# Altium schematic sheet Преобразователь напряжения.SchDoc: Преобразователь
size 420 x 297 mm; ApprovedBy: Капустин; CheckedBy: Капустин; DrawnBy: Хомутов; DocumentNumber: СКТБ.421455.001 Э3; SheetNumber: 1; SheetTotal: 2; Title1str: напряжений; Format: A3
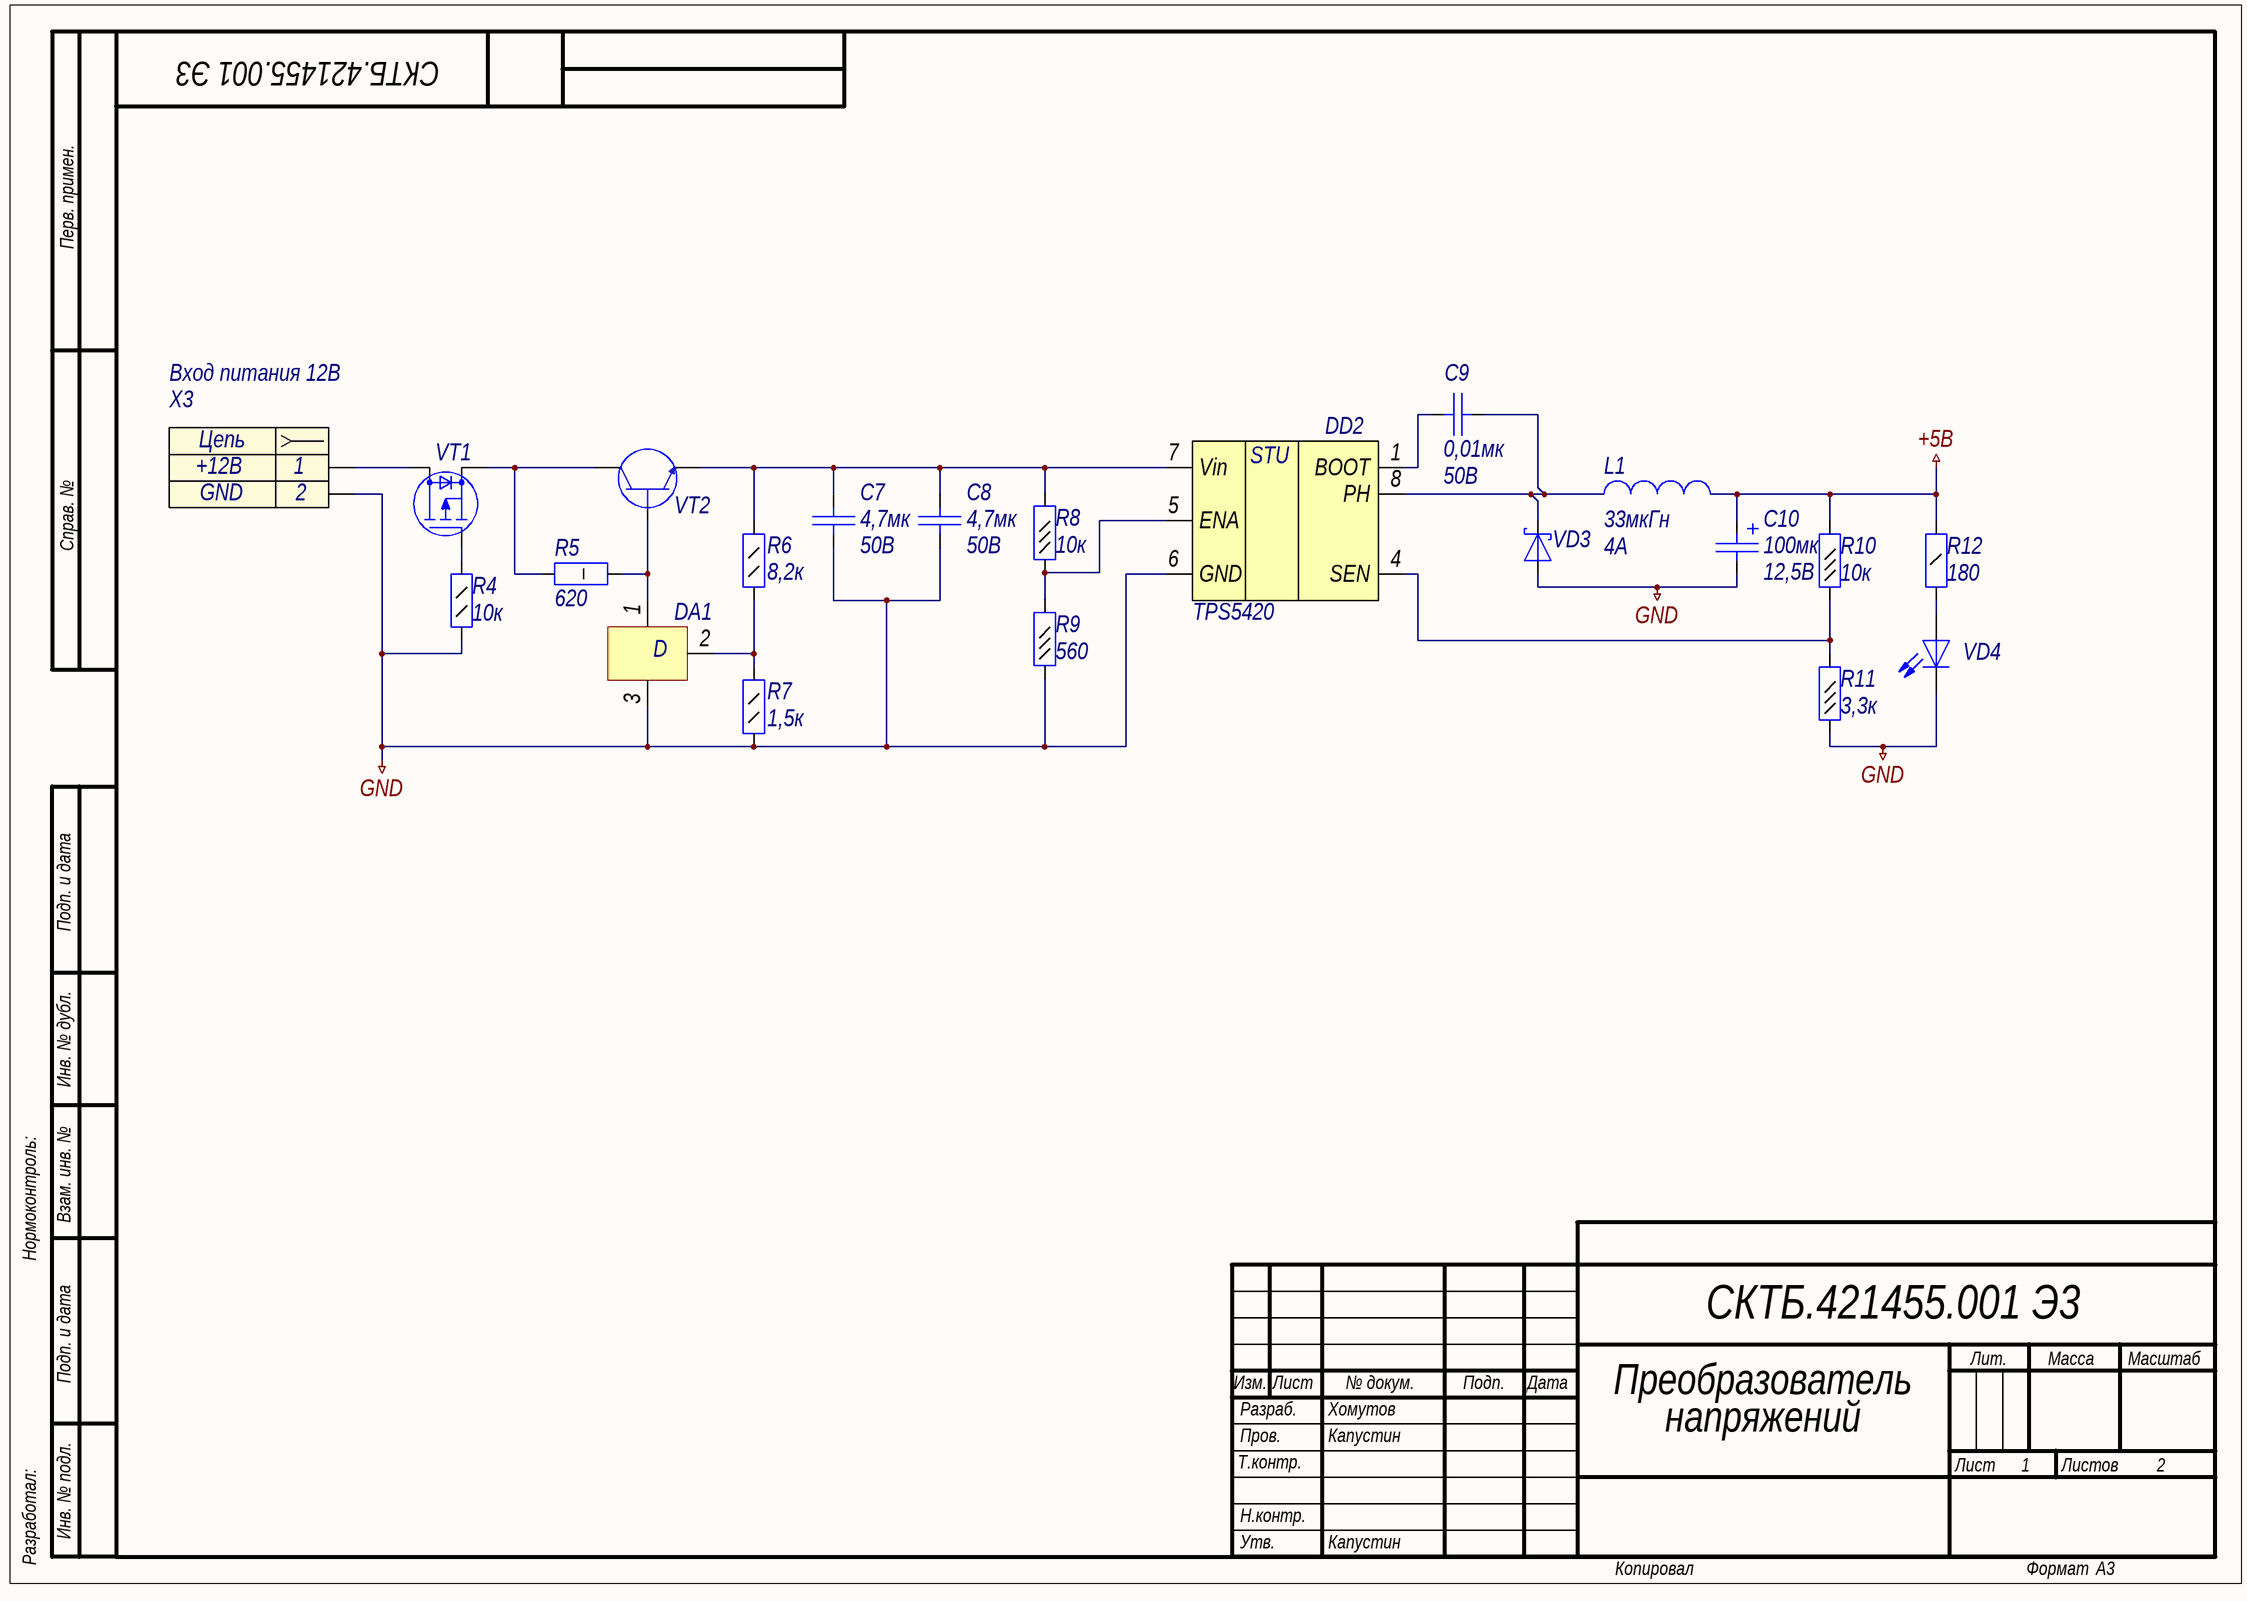
[diagram p0: Преобразователь напряжения.SchDoc]

## Parts
C7  value 4,7мк  Voltage: 50В  [C1206]  (hidden comment: Capacitor)
C8  value 4,7мк  Voltage: 50В  [C1206]  (hidden comment: Capacitor)
C9  value 0,01мк  Voltage: 50B  [C0402]  (hidden comment: Capacitor)
C10  value 100мк  Voltage: 12,5В  [TANTAL CASE E]  (hidden comment: Capacitor_pol)
DA1  TL431  [SOT23-3]  (value not drawn)
DD2  TPS5420  [SO8]
L1  value 33мкГн  Rated Current: 4A  [L4040]  (hidden comment: Inductor)
R4  value 10к  [R0805]  (hidden comment: Resistor_0,125Вт)
R5  value 620  [R2512]  (hidden comment: Resistor_1Вт)
R6  value 8,2к  [R0805]  (hidden comment: Resistor_0,125Вт)
R7  value 1,5к  [R0805]  (hidden comment: Resistor_0,125Вт)
R8  value 10к  [R0402]  (hidden comment: Resistor_0,062Вт)
R9  value 560  [R0402]  (hidden comment: Resistor_0,062Вт)
R10  value 10к  [R0402]  (hidden comment: Resistor_0,062Вт)
R11  value 3,3к  [R0402]  (hidden comment: Resistor_0,062Вт)
R12  value 180  [R1206]  (hidden comment: Resistor_0,25Вт)
VD3  DiodeSchottky  [SMA]  (value not drawn)
VD4  LED  [L_0805]  (value not drawn)
VT1  P-MOSFET  [HD-1]  (value not drawn)
VT2  BJT NPN  [SOT-223]  (value not drawn)
X3  Вход питания 12В  [DS-210]

## Nets
+5В: C10.1 L1.2 R10.2 R12.2
GND: C7.1 C8.1 C10.2 DA1.3 DD2.6(GND) R4.1 R7.1 R9.1 R11.1 VD3.2(A) VD4.1(K) X3.2
NetC7_2: C7.2 C8.2 DD2.7(Vin) R6.2 R8.2 VT2.2
NetC9_1: C9.1 DD2.8(PH) L1.1 VD3.1(K)
NetC9_2: C9.2 DD2.1(BOOT)
NetDA1_1: DA1.1 R5.2 VT2.1
NetDA1_2: DA1.2 R6.1 R7.2
NetDD2_4: DD2.4(SEN) R10.1 R11.2
NetDD2_5: DD2.5(ENA) R8.1 R9.2
NetR4_2: R4.2 VT1.1(G)
NetR5_1: R5.1 VT1.2(S) VT2.3
NetR12_1: R12.1 VD4.2(A)
NetVT1_3: VT1.3(D) X3.1

## Notes on the sheet
- Перв. примен.
- Справ. №
- Подп. и дата
- Инв. № дубл.
- Нормоконтроль:
- Взам. инв. №
- Изм.
- Лист
- № докум.
- Подп.
- Дата
- Лит.
- Масса
- Масштаб
- Т.контр.
- Пров.
- Разраб.
- Листов
- Разработал:
- Инв. № подл.
- Н.контр.
- Утв.
- Копировал
- Формат
- (in symbol connect1) Цепь
- (in symbol pwr13) STU
- (in symbol TL431ACDBZR) D

## Library data of the parts
C7 C8 = cap189: Конденсатор; Part Name: Ceramic; Manufacture: Murata; Part Number: GRM31CR71H475KA12L; id: cap189; TKE: X7R
C9 = cap42: Конденсатор; Part Name: Ceramic; Manufacture: Murata; Part Number: GRM155R71H103K; id: cap42; TKE: X7R
C10 = cap197: Конденсатор полярный; Part Name: Polimer; Manufacture: Murata; Part Number: ECASD91B107M012K00; id: cap197; TKE: 12mOhm
DA1 = TL431ACDBZR: Программируемый стабилитрон; Part Name: Precision Programmable Reference; id: ref1; Voltage min stabilize: 2,5B; Accuracy: 0,01; Working current: 100mA; Part Number: TL431ACDBZR
DD2 = pwr13: 2-A, WIDE INPUT RANGE, STEP-DOWN CONVERTER; Manufacturer: Texas Instruments; id: pwr13; Input Voltage: 5,5 - 36B; Output Voltage: Adj; Current: 2A; Part Name: Step-Down Converter; Type: Impulse; Part Number: TPS5420
L1 = ind8: EMI Suppression Filter; Part Number: IHLP4040DZER330M11; Manufacture: Vishay; id: ind8; Resistance: 94,5mOhm; Part Name: Inductor
R4 = res121: Резистор; Manufacture: Yageo; Part Number: RC0805FR-07100KL; id: res121; Accuracy: 1%; Part Name: Resistor; Power: 0,125Вт
R5 = res840: Резистор; Manufacture: Yageo; Part Number: RC2512FR-07620RL; id: res840; Accuracy: 1%; Power: 1Вт; Part Name: Resistor
R6 = res95: Резистор; Manufacture: Yageo; Part Number: RC0805FR-078K2; id: res95; Accuracy: 1%; Part Name: Resistor; Power: 0,125Вт
R7 = res77: Резистор; Manufacture: Yageo; Part Number: RC0805FR-071K5; id: res77; Accuracy: 1%; Part Name: Resistor; Power: 0,125Вт
R8 R10 = res290: Резистор; Manufacture: Yageo; Part Number: RC0402FR-0710KL; id: res290; Accuracy: 1%; Part Name: Resistor; Power: 0,062Вт
R9 = res260: Резистор; Manufacture: Yageo; Part Number: RC0402FR-07560RL; id: res260; Accuracy: 1%; Part Name: Resistor; Power: 0,062Вт
R11 = res278: Резистор; Manufacture: Yageo; Part Number: RC0402FR-072K3; id: res278; Accuracy: 1%; Part Name: Resistor; Power: 0,062Вт
R12 = res634: Резистор; Manufacture: Yageo; Part Number: RC1206FR-07180RL; id: res634; Accuracy: 1%; Power: 0,25Вт; Part Name: Resistor
VD3 = diode2: Диод Шоттки; Part Number: SK34A; Manufacture: Taiwan Semiconductor; id: diode2; Max Reverse Voltage: 40B; Forward Voltage: 0,55B; Forward Current: 3A; Part Name: Diode Schottky
VD4 = diode8: Светодиод; Part Number: KP-2012EC; id: diode8; Part Name: LED
VT1 = trans1: N-MOSFET; Part Name: Transistor; Part Number: IRFD9024PBF; Manufacturer: Vishay; id: trans1; Structure: p-channel; V drain-source max: (-60B); Rds: 0,28Ohm; Gate-to-source voltage: (+-)20B; Continuous drain current: 2,5A; Pulsed drain current: 20A; Power dissipation: 1,3W
VT2 = bjt3: Part Name: Transistor; Part Number: PBSS4540Z.115; id: bjt3; hfe: 300; Vceo max: 40В; Ic max: 5А; Power: 2Вт; Frequency: 130МГц; Structure: npn
X3 = connect1: Разъем - 2 конт. розетка; Part Name: DC Power Jack; Part Number: DS-210B(PBT)(NB); Contact_1: +12В; Contact_2: GND; id: connect1